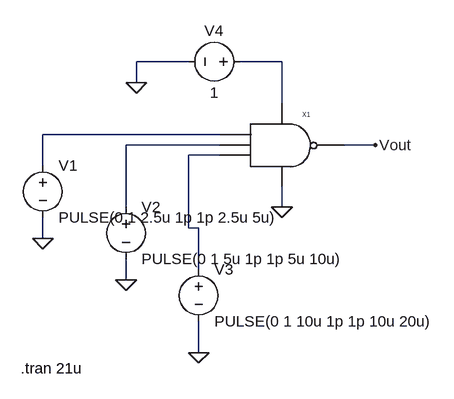
[diagram p0: schematic NAND_test.asc]
NAND_test.asc, the LTspice schematic file:
Version 4
SHEET 1 880 680
WIRE 64 48 -16 48
WIRE 208 48 144 48
WIRE -16 80 -16 48
WIRE 208 112 208 48
WIRE 112 160 -160 160
WIRE 112 176 -32 176
WIRE 352 176 304 176
WIRE 112 192 64 192
WIRE -160 208 -160 160
WIRE -32 272 -32 176
WIRE 208 272 208 240
WIRE 64 304 64 192
WIRE 80 304 64 304
WIRE -160 320 -160 288
WIRE 80 368 80 304
WIRE -32 384 -32 352
WIRE 80 496 80 448
FLAG 208 272 0
FLAG -16 80 0
FLAG -160 320 0
FLAG -32 384 0
FLAG 80 496 0
FLAG 352 176 Vout
SYMBOL NAND 224 176 R0
SYMATTR InstName X1
SYMBOL voltage -160 192 R0
WINDOW 123 0 0 Left 0
WINDOW 39 0 0 Left 0
SYMATTR InstName V1
SYMATTR Value PULSE(0 1 2.5u 1p 1p 2.5u 5u)
SYMBOL voltage -32 256 R0
WINDOW 123 0 0 Left 0
WINDOW 39 0 0 Left 0
SYMATTR InstName V2
SYMATTR Value PULSE(0 1 5u 1p 1p 5u 10u)
SYMBOL voltage 80 352 R0
WINDOW 123 0 0 Left 0
WINDOW 39 0 0 Left 0
SYMATTR InstName V3
SYMATTR Value PULSE(0 1 10u 1p 1p 10u 20u)
SYMBOL voltage 160 48 R90
WINDOW 0 -32 56 VBottom 2
WINDOW 3 32 56 VTop 2
WINDOW 123 0 0 Left 0
WINDOW 39 0 0 Left 0
SYMATTR InstName V4
SYMATTR Value 1
TEXT -194 520 Left 2 !.tran 21u

The netlist it stands for:
* NAND_test.asc
XX1 N002 N003 N004 N001 0 Vout NAND  ; pins A B C VHIGH VLOW Vout
V1 N002 0 PULSE(0 1 2.5u 1p 1p 2.5u 5u)
V2 N003 0 PULSE(0 1 5u 1p 1p 5u 10u)
V3 N004 0 PULSE(0 1 10u 1p 1p 10u 20u)
V4 N001 0 1
.tran 21u
.backanno
.end